# Altium schematic sheet PrzyciskDotykowy_A4_Landscape_.SchDoc
size A4; Author: Michał Berdzik; CompanyName: AGH
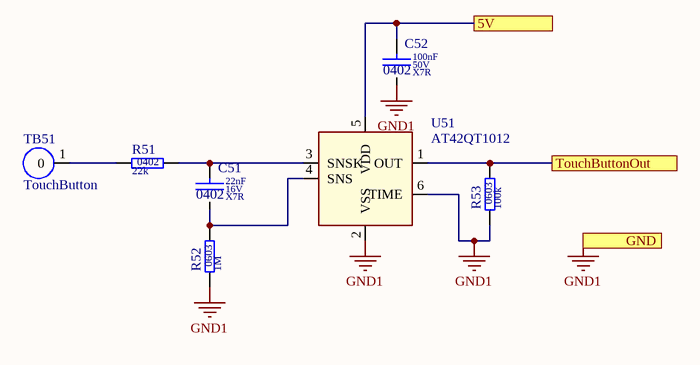
[diagram p0: PrzyciskDotykowy_A4_Landscape_.SchDoc]

## Parts
C51  value 22nF  Dielectric: X7R  Voltage: 16V  SCH_Footprint: 0402  [C_0402_1005]  (hidden comment: Ceramic X7R)
C52  value 100nF  Dielectric: X7R  Voltage: 50V  SCH_Footprint: 0402  [C_0402_1005]  (hidden comment: Ceramic X7R)
R51  value 22k  SCH_Footprint: 0402  [R_0402_1005]  (hidden comment: Resistor)
R52  value 1M  SCH_Footprint: 0603  [R_0603_1608]  (hidden comment: Resistor)
R53  value 100k  SCH_Footprint: 0603  [R_0603_1608]  (hidden comment: Resistor)
TB51  TouchButton  [TouchButton]
U51  AT42QT1012  [AT42QT1012]

## Ports
5V, GND, TouchButtonOut

## Nets
GND1: C52.2 R52.1 R53.1 U51.2(VSS) U51.6(TIME) ; port GND
5V: C52.1 U51.5(VDD) ; port 5V
TouchButtonOut: R53.2 U51.1(OUT) ; port TouchButtonOut
NetC51_1: C51.1 R51.2 U51.3(SNSK)
NetC51_2: C51.2 R52.2 U51.4(SNS)
NetR51_1: R51.1 TB51.1(0)

## Notes on the sheet
- Nazwa uczelni: <Company Name>
- Nazwisko konstruktora:

## Library data of the parts
C51 = C_22nF_16V_X7R_0402_10: Capacitor; Manufacturer: AVX; Manufacturer Part Number: 0402YC223KAT2A; Tolerance (%): 10; Part Number: C_22nF_16V_X7R_0402_10; HelpURL: http://datasheet.octopart.com/0402YC223KAT2A-AVX-datasheet-78690206.pdf; Supplier 1: TME; Supplier Part Number 1: 0402YC223KAT2A; Supplier 2: RS Components; Supplier Part Number 2: 6983188; Supplier 3: Farnell; Supplier Part Number 3: 2280808; Supplier 4: Mouser; Supplier Part Number 4: 581-0402YC223K; Supplier 5: Digi-Key; Supplier Part Number 5: 478-1118-1-ND
C52 = C_100nF_50V_X7R_0402_10: Capacitor; Manufacturer: Murata; Manufacturer Part Number: GRM155R71H104KE14D; Tolerance (%): 10; Part Number: C_100nF_50V_X7R_0402_10; HelpURL: http://docs-europe.electrocomponents.com/webdocs/145f/0900766b8145f9d2.pdf; Supplier 1: TME; Supplier Part Number 1: GRM155R71H104KE14D; Supplier 2: RS Components; Supplier Part Number 2: 8847087; Supplier 3: Farnell; Supplier Part Number 3: 2611912; Supplier 4: Mouser; Supplier Part Number 4: 81-GRM155R71H104KE4D; Supplier 5: Digi-Key; Supplier Part Number 5: 490-10700-1-ND
R51 = R_22k_0402: Manufacturer: Panasonic; Manufacturer Part Number: ERA-2AEB223X; Voltage: 50V; Power: 63mW; Tolerance: 1%; Part Number: R_22k_0402; HelpURL: http://www.mouser.com/ds/2/315/AOA0000C237-1100991.pdf; Supplier 1: TME; Supplier 2: RS Components; Supplier Part Number 2: 566557; Supplier 3: Farnell; Supplier Part Number 3: 1577719; Supplier 4: Mouser; Supplier Part Number 4: 667-ERA-2AEB223X; Supplier 5: Digi-Key; Supplier Part Number 5: P22KDCCT-ND
R52 = R_1M_0603_1: Manufacturer: Bourns; Manufacturer Part Number: CR0603-FX-1004ELF; Voltage: 50V; Power: 100mW; Tolerance: 1%; Part Number: R_1M_0603_1; HelpURL: https://datasheet.octopart.com/CR0603-FX-1004ELF-Bourns-datasheet-5318152.pdf; Supplier 1: TME; Supplier 2: RS Components; Supplier 3: Farnell; Supplier Part Number 3: 2321755; Supplier 4: Mouser; Supplier Part Number 4: 652-CR0603FX-1004ELF; Supplier 5: Digi-Key; Supplier Part Number 5: CR0603-FX-1004ELFCT-ND
R53 = R_100k_0603_1: Manufacturer: Royalohm; Manufacturer Part Number: 0603SAF1003T5E; Voltage: 50V; Power: 100mW; Tolerance: 1%; Part Number: R_100k_0603_1; HelpURL: http://www.tme.eu/pl/Document/b315665a56acbc42df513c99b390ad98/ROYALOHM-THICKFILM.pdf; Supplier 1: TME; Supplier Part Number 1: SMD0603-100K-1%; Supplier 2: RS Components; Supplier 3: Farnell; Supplier 4: Mouser; Supplier Part Number 4: 667-ERJ-3EKF1003V; Supplier 5: Digi-Key; Supplier Part Number 5: P100KHCT-ND
TB51 = TouchButton: Value: *; SupplierPartNumber: *; Supplier: *
U51 = AT42QT1012: Value: *; SupplierPartNumber: *; Supplier: *